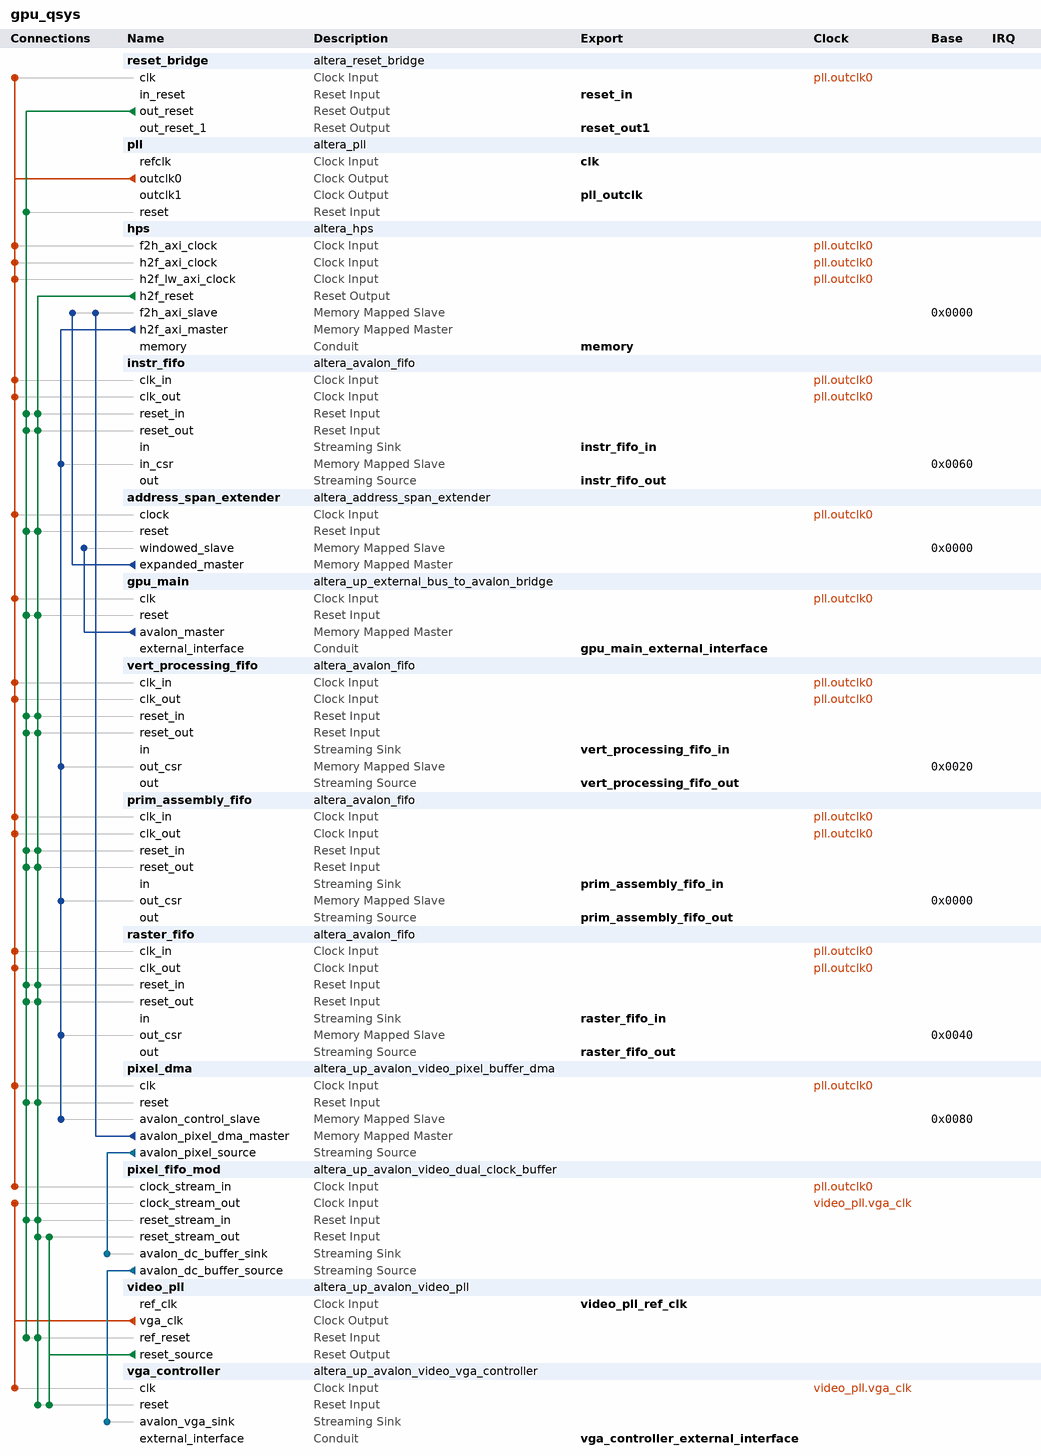
[diagram p0: system contents]
# Platform Designer (Qsys) system gpu_qsys, Cyclone V 5CSEMA5F31C6
# Parameters at their usual value, and those the tool derives, are not listed.
package require -exact qsys 19.1
create_system gpu_qsys
set_project_property DEVICE_FAMILY {Cyclone V}
set_project_property DEVICE 5CSEMA5F31C6

add_instance reset_bridge altera_reset_bridge 19.1
set_instance_parameter_value reset_bridge ACTIVE_LOW_RESET 0
set_instance_parameter_value reset_bridge NUM_RESET_OUTPUTS 2
set_instance_parameter_value reset_bridge SYNCHRONOUS_EDGES deassert

add_instance pll altera_pll 19.1
set_instance_parameter_value pll gui_device_speed_grade 2
set_instance_parameter_value pll gui_number_of_clocks 2
set_instance_parameter_value pll gui_operation_mode normal
set_instance_parameter_value pll gui_output_clock_frequency0 143.0
set_instance_parameter_value pll gui_output_clock_frequency1 143.0
set_instance_parameter_value pll gui_pll_bandwidth_preset High
set_instance_parameter_value pll gui_pll_mode {Integer-N PLL}
set_instance_parameter_value pll gui_reference_clock_frequency 50.0
set_instance_parameter_value pll gui_use_locked false

add_instance hps altera_hps 19.1
set_instance_parameter_value hps EMAC1_Mode N/A
set_instance_parameter_value hps EMAC1_PinMuxing Unused
set_instance_parameter_value hps F2SCLK_COLDRST_Enable false
set_instance_parameter_value hps F2SCLK_DBGRST_Enable false
set_instance_parameter_value hps F2SCLK_WARMRST_Enable false
set_instance_parameter_value hps F2SINTERRUPT_Enable false
set_instance_parameter_value hps F2S_Width 1
set_instance_parameter_value hps FPGA_PERIPHERAL_OUTPUT_CLOCK_FREQ_EMAC0_GTX_CLK 125
set_instance_parameter_value hps FPGA_PERIPHERAL_OUTPUT_CLOCK_FREQ_EMAC0_MD_CLK 2.5
set_instance_parameter_value hps FPGA_PERIPHERAL_OUTPUT_CLOCK_FREQ_EMAC1_GTX_CLK 125
set_instance_parameter_value hps FPGA_PERIPHERAL_OUTPUT_CLOCK_FREQ_EMAC1_MD_CLK 2.5
set_instance_parameter_value hps HPS_PROTOCOL DDR3
set_instance_parameter_value hps I2C0_Mode N/A
set_instance_parameter_value hps I2C0_PinMuxing Unused
set_instance_parameter_value hps I2C1_Mode N/A
set_instance_parameter_value hps I2C1_PinMuxing Unused
set_instance_parameter_value hps LWH2F_Enable true
set_instance_parameter_value hps MEM_BANKADDR_WIDTH 3
set_instance_parameter_value hps MEM_CLK_FREQ 400.0
set_instance_parameter_value hps MEM_CLK_FREQ_MAX 400.0
set_instance_parameter_value hps MEM_COL_ADDR_WIDTH 8
set_instance_parameter_value hps MEM_DQ_WIDTH 8
set_instance_parameter_value hps MEM_DRV_STR RZQ/6
set_instance_parameter_value hps MEM_ROW_ADDR_WIDTH 12
set_instance_parameter_value hps MEM_RTT_NOM {ODT Disabled}
set_instance_parameter_value hps MEM_RTT_WR {Dynamic ODT off}
set_instance_parameter_value hps MEM_TCL 7
set_instance_parameter_value hps MEM_TFAW_NS 37.5
set_instance_parameter_value hps MEM_TINIT_US 499
set_instance_parameter_value hps MEM_TMRD_CK 3
set_instance_parameter_value hps MEM_TRAS_NS 40.0
set_instance_parameter_value hps MEM_TRCD_NS 15.0
set_instance_parameter_value hps MEM_TREFI_US 7.0
set_instance_parameter_value hps MEM_TRFC_NS 75.0
set_instance_parameter_value hps MEM_TRP_NS 15.0
set_instance_parameter_value hps MEM_TWTR 2
set_instance_parameter_value hps MEM_VENDOR JEDEC
set_instance_parameter_value hps MEM_WTCL 6
set_instance_parameter_value hps QSPI_Mode N/A
set_instance_parameter_value hps QSPI_PinMuxing Unused
set_instance_parameter_value hps REF_CLK_FREQ 25.0
set_instance_parameter_value hps S2FCLK_USER2CLK 5
set_instance_parameter_value hps S2F_Width 1
set_instance_parameter_value hps SDIO_Mode N/A
set_instance_parameter_value hps SDIO_PinMuxing Unused
set_instance_parameter_value hps SPIM1_Mode N/A
set_instance_parameter_value hps SPIM1_PinMuxing Unused
set_instance_parameter_value hps STM_Enable false
set_instance_parameter_value hps TIMING_BOARD_AC_SKEW 0.02
set_instance_parameter_value hps TIMING_BOARD_AC_TO_CK_SKEW 0.0
set_instance_parameter_value hps TIMING_BOARD_DQ_TO_DQS_SKEW 0.0
set_instance_parameter_value hps TIMING_BOARD_MAX_CK_DELAY 0.6
set_instance_parameter_value hps TIMING_BOARD_MAX_DQS_DELAY 0.6
set_instance_parameter_value hps TIMING_BOARD_SKEW_BETWEEN_DQS 0.02
set_instance_parameter_value hps TIMING_BOARD_SKEW_CKDQS_DIMM_MAX 0.01
set_instance_parameter_value hps TIMING_BOARD_SKEW_CKDQS_DIMM_MIN -0.01
set_instance_parameter_value hps TIMING_BOARD_SKEW_WITHIN_DQS 0.02
set_instance_parameter_value hps TIMING_TDH 125
set_instance_parameter_value hps TIMING_TDQSCK 400
set_instance_parameter_value hps TIMING_TDQSQ 120
set_instance_parameter_value hps TIMING_TDS 50
set_instance_parameter_value hps TIMING_TIH 250
set_instance_parameter_value hps TIMING_TIS 175
set_instance_parameter_value hps TIMING_TQSH 0.38
set_instance_parameter_value hps UART0_Mode N/A
set_instance_parameter_value hps UART0_PinMuxing Unused
set_instance_parameter_value hps USB1_Mode N/A
set_instance_parameter_value hps USB1_PinMuxing Unused
set_instance_parameter_value hps desired_cfg_clk_mhz 100.0
set_instance_parameter_value hps desired_qspi_clk_mhz 400.0

add_instance instr_fifo altera_avalon_fifo 19.1
set_instance_parameter_value instr_fifo bitsPerSymbol 32
set_instance_parameter_value instr_fifo channelWidth 0
set_instance_parameter_value instr_fifo errorWidth 0
set_instance_parameter_value instr_fifo fifoDepth 4096
set_instance_parameter_value instr_fifo fifoInputInterfaceOptions AVALONST_SINK
set_instance_parameter_value instr_fifo fifoOutputInterfaceOptions AVALONST_SOURCE
set_instance_parameter_value instr_fifo singleClockMode false
set_instance_parameter_value instr_fifo symbolsPerBeat 1
set_instance_parameter_value instr_fifo useIRQ false
set_instance_parameter_value instr_fifo usePacket false
set_instance_parameter_value instr_fifo useReadControl true

add_instance address_span_extender altera_address_span_extender 19.1
set_instance_parameter_value address_span_extender BURSTCOUNT_WIDTH 1
set_instance_parameter_value address_span_extender DATA_WIDTH 32
set_instance_parameter_value address_span_extender ENABLE_SLAVE_PORT false
set_instance_parameter_value address_span_extender MASTER_ADDRESS_DEF 0
set_instance_parameter_value address_span_extender MAX_PENDING_READS 1
set_instance_parameter_value address_span_extender SLAVE_ADDRESS_WIDTH 28

add_instance gpu_main altera_up_external_bus_to_avalon_bridge 18.0
set_instance_parameter_value gpu_main addr_size 1024
set_instance_parameter_value gpu_main addr_size_multiplier Mbytes
set_instance_parameter_value gpu_main data_size 32

add_instance vert_processing_fifo altera_avalon_fifo 19.1
set_instance_parameter_value vert_processing_fifo bitsPerSymbol 32
set_instance_parameter_value vert_processing_fifo channelWidth 0
set_instance_parameter_value vert_processing_fifo errorWidth 0
set_instance_parameter_value vert_processing_fifo fifoDepth 4096
set_instance_parameter_value vert_processing_fifo fifoInputInterfaceOptions AVALONST_SINK
set_instance_parameter_value vert_processing_fifo fifoOutputInterfaceOptions AVALONST_SOURCE
set_instance_parameter_value vert_processing_fifo singleClockMode false
set_instance_parameter_value vert_processing_fifo symbolsPerBeat 1
set_instance_parameter_value vert_processing_fifo useIRQ false
set_instance_parameter_value vert_processing_fifo usePacket false
set_instance_parameter_value vert_processing_fifo useReadControl true

add_instance prim_assembly_fifo altera_avalon_fifo 19.1
set_instance_parameter_value prim_assembly_fifo bitsPerSymbol 32
set_instance_parameter_value prim_assembly_fifo channelWidth 0
set_instance_parameter_value prim_assembly_fifo errorWidth 0
set_instance_parameter_value prim_assembly_fifo fifoDepth 4096
set_instance_parameter_value prim_assembly_fifo fifoInputInterfaceOptions AVALONST_SINK
set_instance_parameter_value prim_assembly_fifo fifoOutputInterfaceOptions AVALONST_SOURCE
set_instance_parameter_value prim_assembly_fifo singleClockMode false
set_instance_parameter_value prim_assembly_fifo symbolsPerBeat 1
set_instance_parameter_value prim_assembly_fifo useIRQ false
set_instance_parameter_value prim_assembly_fifo usePacket false
set_instance_parameter_value prim_assembly_fifo useReadControl true

add_instance raster_fifo altera_avalon_fifo 19.1
set_instance_parameter_value raster_fifo bitsPerSymbol 32
set_instance_parameter_value raster_fifo channelWidth 0
set_instance_parameter_value raster_fifo errorWidth 0
set_instance_parameter_value raster_fifo fifoDepth 4096
set_instance_parameter_value raster_fifo fifoInputInterfaceOptions AVALONST_SINK
set_instance_parameter_value raster_fifo fifoOutputInterfaceOptions AVALONST_SOURCE
set_instance_parameter_value raster_fifo singleClockMode false
set_instance_parameter_value raster_fifo symbolsPerBeat 1
set_instance_parameter_value raster_fifo useIRQ false
set_instance_parameter_value raster_fifo usePacket false
set_instance_parameter_value raster_fifo useReadControl true

add_instance pixel_dma altera_up_avalon_video_pixel_buffer_dma 18.0
set_instance_parameter_value pixel_dma addr_mode Consecutive
set_instance_parameter_value pixel_dma back_start_address 838860800
set_instance_parameter_value pixel_dma color_space {30-bit RGB}
set_instance_parameter_value pixel_dma image_height 600
set_instance_parameter_value pixel_dma image_width 800
set_instance_parameter_value pixel_dma start_address 838860800

add_instance pixel_fifo_mod altera_up_avalon_video_dual_clock_buffer 18.0
set_instance_parameter_value pixel_fifo_mod color_bits 10

add_instance video_pll altera_up_avalon_video_pll 18.0
set_instance_parameter_value video_pll camera {5MP Digital Camera (THDB_D5M)}
set_instance_parameter_value video_pll gui_refclk 50.0
set_instance_parameter_value video_pll gui_resolution {SVGA 800x600}
set_instance_parameter_value video_pll lcd {7" LCD on VEEK-MT and MTL/MTL2 Modules}

add_instance vga_controller altera_up_avalon_video_vga_controller 18.0
set_instance_parameter_value vga_controller board DE1-SoC
set_instance_parameter_value vga_controller resolution {SVGA 800x600}

# connections
add_connection pll.outclk0 address_span_extender.clock clock
add_connection pll.outclk0 gpu_main.clk clock
add_connection pll.outclk0 hps.f2h_axi_clock clock
add_connection pll.outclk0 hps.h2f_axi_clock clock
add_connection pll.outclk0 hps.h2f_lw_axi_clock clock
add_connection pll.outclk0 instr_fifo.clk_in clock
add_connection pll.outclk0 instr_fifo.clk_out clock
add_connection pll.outclk0 pixel_dma.clk clock
add_connection pll.outclk0 pixel_fifo_mod.clock_stream_in clock
add_connection pll.outclk0 prim_assembly_fifo.clk_in clock
add_connection pll.outclk0 prim_assembly_fifo.clk_out clock
add_connection pll.outclk0 raster_fifo.clk_in clock
add_connection pll.outclk0 raster_fifo.clk_out clock
add_connection pll.outclk0 reset_bridge.clk clock
add_connection pll.outclk0 vert_processing_fifo.clk_in clock
add_connection pll.outclk0 vert_processing_fifo.clk_out clock
add_connection video_pll.vga_clk pixel_fifo_mod.clock_stream_out clock
add_connection video_pll.vga_clk vga_controller.clk clock
add_connection hps.h2f_reset address_span_extender.reset reset
add_connection hps.h2f_reset gpu_main.reset reset
add_connection hps.h2f_reset instr_fifo.reset_in reset
add_connection hps.h2f_reset instr_fifo.reset_out reset
add_connection hps.h2f_reset pixel_dma.reset reset
add_connection hps.h2f_reset pixel_fifo_mod.reset_stream_in reset
add_connection hps.h2f_reset pixel_fifo_mod.reset_stream_out reset
add_connection hps.h2f_reset prim_assembly_fifo.reset_in reset
add_connection hps.h2f_reset prim_assembly_fifo.reset_out reset
add_connection hps.h2f_reset raster_fifo.reset_in reset
add_connection hps.h2f_reset raster_fifo.reset_out reset
add_connection hps.h2f_reset vert_processing_fifo.reset_in reset
add_connection hps.h2f_reset vert_processing_fifo.reset_out reset
add_connection hps.h2f_reset vga_controller.reset reset
add_connection hps.h2f_reset video_pll.ref_reset reset
add_connection reset_bridge.out_reset address_span_extender.reset reset
add_connection reset_bridge.out_reset gpu_main.reset reset
add_connection reset_bridge.out_reset instr_fifo.reset_in reset
add_connection reset_bridge.out_reset instr_fifo.reset_out reset
add_connection reset_bridge.out_reset pixel_dma.reset reset
add_connection reset_bridge.out_reset pixel_fifo_mod.reset_stream_in reset
add_connection reset_bridge.out_reset pll.reset reset
add_connection reset_bridge.out_reset prim_assembly_fifo.reset_in reset
add_connection reset_bridge.out_reset prim_assembly_fifo.reset_out reset
add_connection reset_bridge.out_reset raster_fifo.reset_in reset
add_connection reset_bridge.out_reset raster_fifo.reset_out reset
add_connection reset_bridge.out_reset vert_processing_fifo.reset_in reset
add_connection reset_bridge.out_reset vert_processing_fifo.reset_out reset
add_connection reset_bridge.out_reset video_pll.ref_reset reset
add_connection video_pll.reset_source pixel_fifo_mod.reset_stream_out reset
add_connection video_pll.reset_source vga_controller.reset reset
add_connection address_span_extender.expanded_master hps.f2h_axi_slave avalon
set_connection_parameter_value address_span_extender.expanded_master/hps.f2h_axi_slave baseAddress 0x0000
add_connection gpu_main.avalon_master address_span_extender.windowed_slave avalon
set_connection_parameter_value gpu_main.avalon_master/address_span_extender.windowed_slave baseAddress 0x0000
add_connection hps.h2f_axi_master instr_fifo.in_csr avalon
set_connection_parameter_value hps.h2f_axi_master/instr_fifo.in_csr baseAddress 0x0060
add_connection hps.h2f_axi_master pixel_dma.avalon_control_slave avalon
set_connection_parameter_value hps.h2f_axi_master/pixel_dma.avalon_control_slave baseAddress 0x0080
add_connection hps.h2f_axi_master prim_assembly_fifo.out_csr avalon
set_connection_parameter_value hps.h2f_axi_master/prim_assembly_fifo.out_csr baseAddress 0x0000
add_connection hps.h2f_axi_master raster_fifo.out_csr avalon
set_connection_parameter_value hps.h2f_axi_master/raster_fifo.out_csr baseAddress 0x0040
add_connection hps.h2f_axi_master vert_processing_fifo.out_csr avalon
set_connection_parameter_value hps.h2f_axi_master/vert_processing_fifo.out_csr baseAddress 0x0020
add_connection pixel_dma.avalon_pixel_dma_master hps.f2h_axi_slave avalon
set_connection_parameter_value pixel_dma.avalon_pixel_dma_master/hps.f2h_axi_slave baseAddress 0x0000
add_connection pixel_dma.avalon_pixel_source pixel_fifo_mod.avalon_dc_buffer_sink avalon_streaming
add_connection pixel_fifo_mod.avalon_dc_buffer_source vga_controller.avalon_vga_sink avalon_streaming

# exported interfaces
add_interface clk clock sink
set_interface_property clk EXPORT_OF pll.refclk
add_interface gpu_main_external_interface conduit end
set_interface_property gpu_main_external_interface EXPORT_OF gpu_main.external_interface
add_interface instr_fifo_in avalon_streaming sink
set_interface_property instr_fifo_in EXPORT_OF instr_fifo.in
add_interface instr_fifo_out avalon_streaming source
set_interface_property instr_fifo_out EXPORT_OF instr_fifo.out
add_interface memory conduit end
set_interface_property memory EXPORT_OF hps.memory
add_interface pll_outclk clock source
set_interface_property pll_outclk EXPORT_OF pll.outclk1
add_interface prim_assembly_fifo_in avalon_streaming sink
set_interface_property prim_assembly_fifo_in EXPORT_OF prim_assembly_fifo.in
add_interface prim_assembly_fifo_out avalon_streaming source
set_interface_property prim_assembly_fifo_out EXPORT_OF prim_assembly_fifo.out
add_interface raster_fifo_in avalon_streaming sink
set_interface_property raster_fifo_in EXPORT_OF raster_fifo.in
add_interface raster_fifo_out avalon_streaming source
set_interface_property raster_fifo_out EXPORT_OF raster_fifo.out
add_interface reset_in reset sink
set_interface_property reset_in EXPORT_OF reset_bridge.in_reset
add_interface reset_out1 reset source
set_interface_property reset_out1 EXPORT_OF reset_bridge.out_reset_1
add_interface vert_processing_fifo_in avalon_streaming sink
set_interface_property vert_processing_fifo_in EXPORT_OF vert_processing_fifo.in
add_interface vert_processing_fifo_out avalon_streaming source
set_interface_property vert_processing_fifo_out EXPORT_OF vert_processing_fifo.out
add_interface vga_controller_external_interface conduit end
set_interface_property vga_controller_external_interface EXPORT_OF vga_controller.external_interface
add_interface video_pll_ref_clk clock sink
set_interface_property video_pll_ref_clk EXPORT_OF video_pll.ref_clk

set_interconnect_requirement {$system} qsys_mm.clockCrossingAdapter HANDSHAKE
set_interconnect_requirement {$system} qsys_mm.enableEccProtection FALSE
set_interconnect_requirement {$system} qsys_mm.insertDefaultSlave FALSE
set_interconnect_requirement {$system} qsys_mm.maxAdditionalLatency 1

save_system gpu_qsys.qsys
